# Altium project PCB_Project.PrjPcb
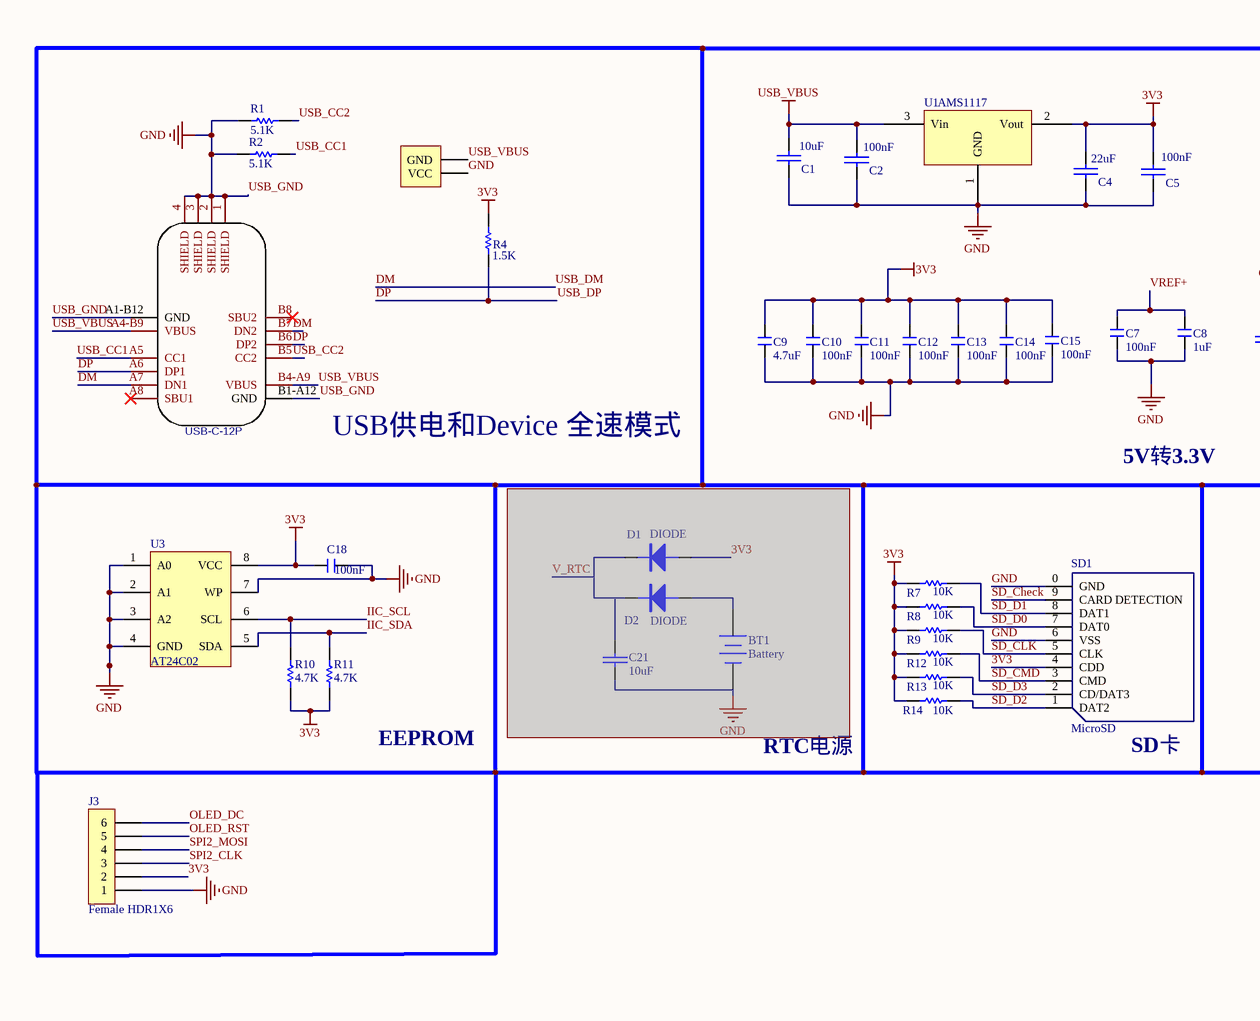
[diagram p0: Sheet1.SchDoc, top left]
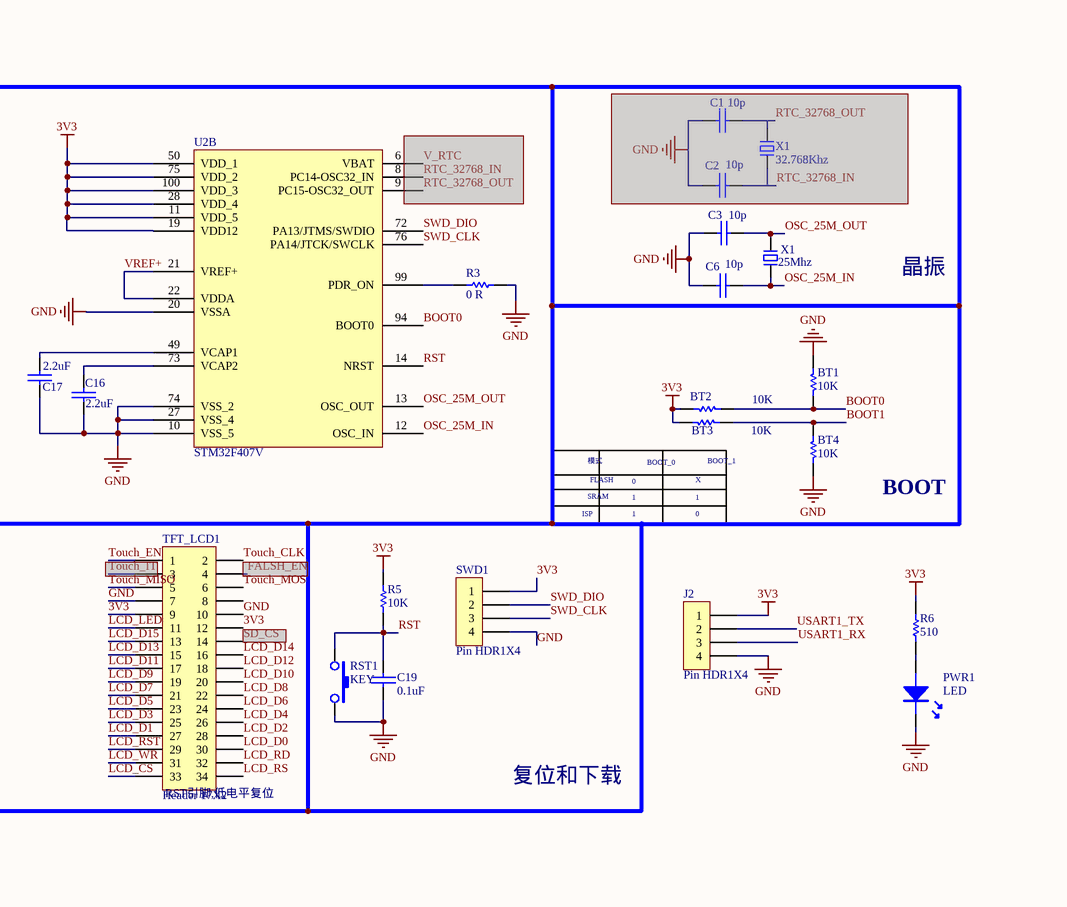
[diagram p1: Sheet1.SchDoc, top middle]
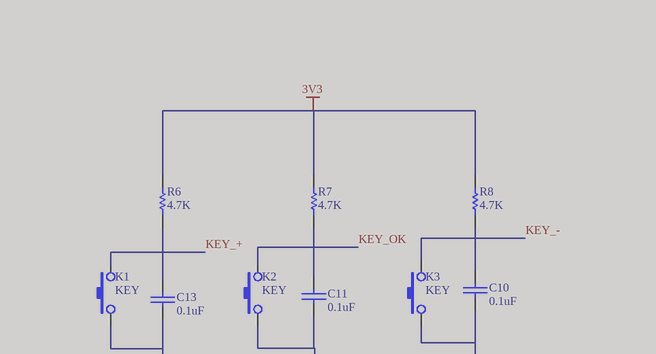
[diagram p2: Sheet1.SchDoc, top right]
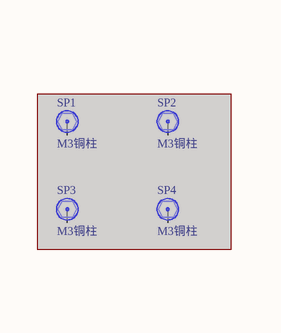
[diagram p3: Sheet1.SchDoc, bottom left]
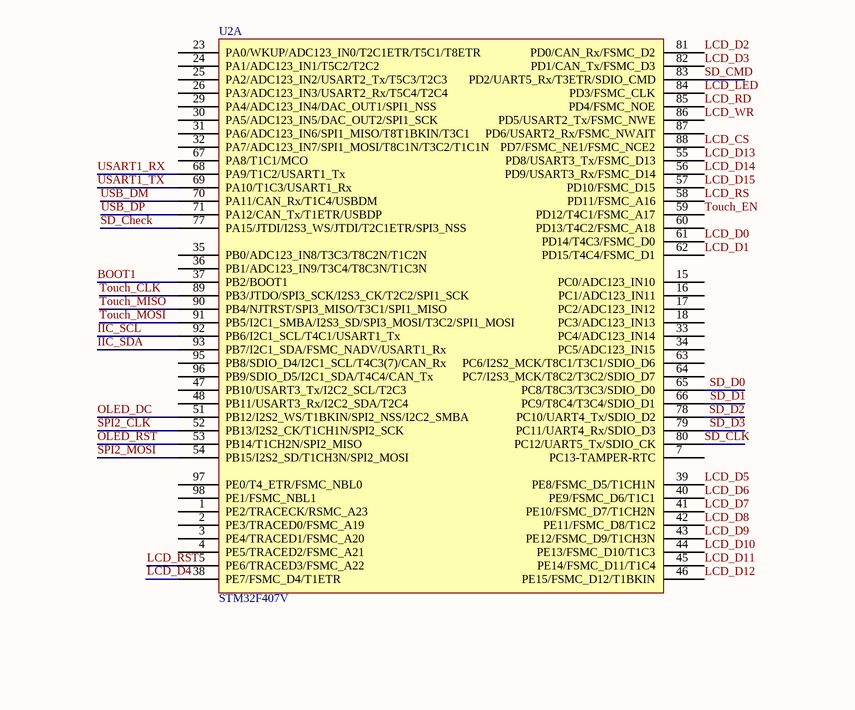
[diagram p4: Sheet1.SchDoc, bottom middle]
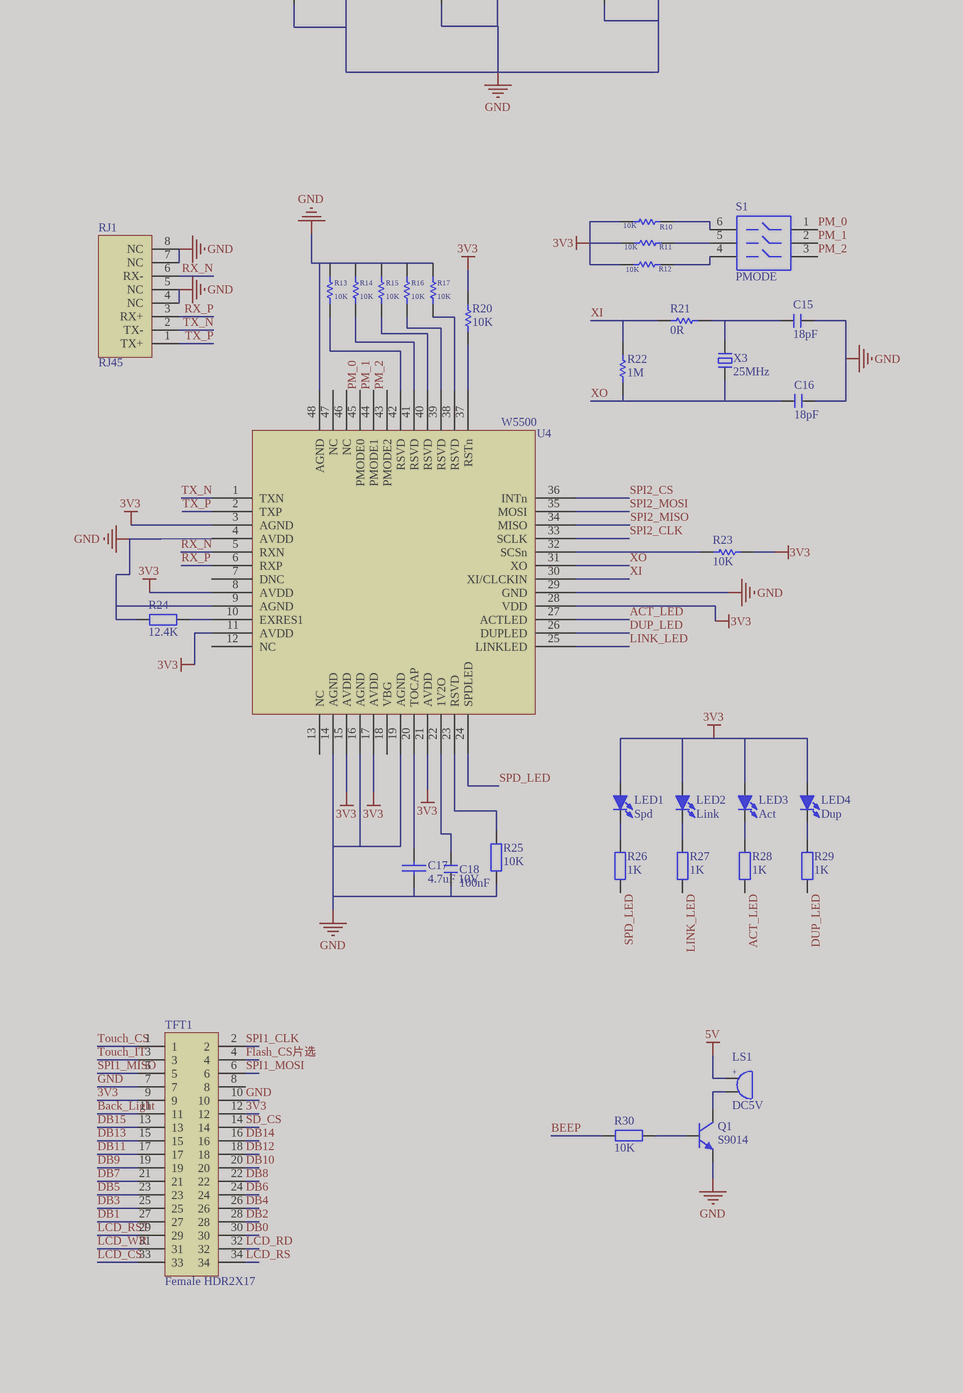
[diagram p5: Sheet1.SchDoc, bottom right]
1 sheet, 104 parts. Net scope: global (net labels, ports and power ports of the same name join across sheets).
Board file: PCB1.PcbDoc

## Sheet Sheet1.SchDoc
size A1

### Parts
(Parts that share a designator on the sheet are numbered #1, #2 ... from top to bottom, then left to right.)
1  USB-C-12P  [USB-C-12P]
BT1#1  10K  [0603R]
BT1#2  Battery  [CR1220]  (masked out: inside a compile mask, not in the netlist)
BT2  10K  [0603R]
BT3  10K  [0603R]
BT4  10K  [0603R]
C1#1  10p  [0603C]  (masked out: inside a compile mask, not in the netlist)
C1#2  10uF  [0603C]
C2#1  10p  [0603C]  (masked out: inside a compile mask, not in the netlist)
C2#2  100nF  [0603C]
C3  10p  [0603C]
C4  22uF  [0603C]
C5  100nF  [0603C]
C6  10p  [0603C]
C7  100nF  [C 0603_L]
C8  1uF  [C 0603_L]
C9  4.7uF  [C 0603_L]
C10#1  100nF  [C 0603_L]
C10#2  0.1uF  [0805C]  (masked out: inside a compile mask, not in the netlist)
C11#1  100nF  [C 0603_L]
C11#2  0.1uF  [0805C]  (masked out: inside a compile mask, not in the netlist)
C12  100nF  [C 0603_L]
C13#1  100nF  [C 0603_L]
C13#2  0.1uF  [0805C]  (masked out: inside a compile mask, not in the netlist)
C14  100nF  [C 0603_L]
C15#1  100nF  [C 0603_L]
C15#2  18pF  [C 0603_M]  (masked out: inside a compile mask, not in the netlist)
C16#1  2.2uF  [0603C]
C16#2  18pF  [C 0603_M]  (masked out: inside a compile mask, not in the netlist)
C17#1  2.2uF  [0603C]
C17#2  4.7uF 10V  [0603C]  (masked out: inside a compile mask, not in the netlist)
C18#1  100nF  [C 0603_M]
C18#2  100nF  [C 0805_L]  (masked out: inside a compile mask, not in the netlist)
C19  0.1uF  [0603C]
C21  10uF  [0603C]  (masked out: inside a compile mask, not in the netlist)
D1  DIODE  [SOD-323]  (masked out: inside a compile mask, not in the netlist)
D2  DIODE  [SOD-323]  (masked out: inside a compile mask, not in the netlist)
J1  Power-2P  [XH2.54-2]  (value not drawn)
J2  Pin HDR1X4  [Pin HDR1X4/2.54mm-S]
J3  Female HDR1X6  [Fe-HDR1X6/2.54-S]
K1  KEY  [DIP-6X6X5]  (masked out: inside a compile mask, not in the netlist)
K2  KEY  [DIP-6X6X5]  (masked out: inside a compile mask, not in the netlist)
K3  KEY  [DIP-6X6X5]  (masked out: inside a compile mask, not in the netlist)
LED1  Spd  [LED 0805R]  (masked out: inside a compile mask, not in the netlist)
LED2  Link  [LED 0805G]  (masked out: inside a compile mask, not in the netlist)
LED3  Act  [LED 0805B]  (masked out: inside a compile mask, not in the netlist)
LED4  Dup  [LED 0805Y]  (masked out: inside a compile mask, not in the netlist)
LS1  DC5V  [BEEP 5x9x5.5]  (masked out: inside a compile mask, not in the netlist)
PWR1  LED  [LED-0603G]
Q1  S9014  [SOT23-3M]  (masked out: inside a compile mask, not in the netlist)
R1  5.1K  [0603R]
R2  5.1K  [0603R]
R3  0 R  [0603R]
R4  1.5K  [0603R]
R5  10K  [0603R]
R6#1  510  [0603R]
R6#2  4.7K  [0603R]  (masked out: inside a compile mask, not in the netlist)
R7#1  10K  [0603R]
R7#2  4.7K  [0603R]  (masked out: inside a compile mask, not in the netlist)
R8#1  10K  [0603R]
R8#2  4.7K  [0603R]  (masked out: inside a compile mask, not in the netlist)
R9  10K  [0603R]
R10#1  4.7K  [0603R]
R10#2  10K  [0603R]  (masked out: inside a compile mask, not in the netlist)
R11#1  4.7K  [0603R]
R11#2  10K  [0603R]  (masked out: inside a compile mask, not in the netlist)
R12#1  10K  [0603R]
R12#2  10K  [0603R]  (masked out: inside a compile mask, not in the netlist)
R13#1  10K  [0603R]
R13#2  10K  [0603R]  (masked out: inside a compile mask, not in the netlist)
R14#1  10K  [0603R]
R14#2  10K  [0603R]  (masked out: inside a compile mask, not in the netlist)
R15  10K  [0603R]  (masked out: inside a compile mask, not in the netlist)
R16  10K  [0603R]  (masked out: inside a compile mask, not in the netlist)
R17  10K  [0603R]  (masked out: inside a compile mask, not in the netlist)
R20  10K  [0603R]  (masked out: inside a compile mask, not in the netlist)
R21  0R  [0603R]  (masked out: inside a compile mask, not in the netlist)
R22  1M  [0603R]  (masked out: inside a compile mask, not in the netlist)
R23  10K  [0603R]  (masked out: inside a compile mask, not in the netlist)
R24  12.4K  [R 0603_L]  (masked out: inside a compile mask, not in the netlist)
R25  10K  [R 0603_M]  (masked out: inside a compile mask, not in the netlist)
R26  1K  [R 0805_L]  (masked out: inside a compile mask, not in the netlist)
R27  1K  [R 0805_L]  (masked out: inside a compile mask, not in the netlist)
R28  1K  [R 0805_L]  (masked out: inside a compile mask, not in the netlist)
R29  1K  [R 0805_L]  (masked out: inside a compile mask, not in the netlist)
R30  10K  [R 0603_M]  (masked out: inside a compile mask, not in the netlist)
RJ1  RJ45  [RJ45-2]  (masked out: inside a compile mask, not in the netlist)
RST1  KEY  [DIP-3X6X5]
S1  PMODE  [DIP-3P_R]  (masked out: inside a compile mask, not in the netlist)
SD1  MicroSD  [Micro SD]
SP1  M3铜柱  [M3x5_L]  (masked out: inside a compile mask, not in the netlist)
SP2  M3铜柱  [M3x5_L]  (masked out: inside a compile mask, not in the netlist)
SP3  M3铜柱  [M3x5_L]  (masked out: inside a compile mask, not in the netlist)
SP4  M3铜柱  [M3x5_L]  (masked out: inside a compile mask, not in the netlist)
SWD1  Pin HDR1X4  [Pin HDR1X4/2.54mm-S]
TFT1  Female HDR2X17  [Fe-HDR2X17/2.54-S]  (masked out: inside a compile mask, not in the netlist)
TFT_LCD1  Header 17X2  [Fe-HDR2X17/2.54-S]
U1  AMS1117  [SOT223]
U2  STM32F407V  [LQFP100 14x14_M]  (parts A,B of 2)
U3  AT24C02  [SOP8]
U4  W5500  [LQFP48]  (masked out: inside a compile mask, not in the netlist)
X1#1  32.768Khz  [OSC-3x8-WI-B]  (masked out: inside a compile mask, not in the netlist)
X1#2  25Mhz  [OSC 5032-2P]
X3  25MHz  [OSC 6035-2P]  (masked out: inside a compile mask, not in the netlist)

### Nets
3V3: BT2.1 BT3.1 C4.2 C5.2 C9.1 C10#1.1 C11#1.1 C12.1 C13#1.1 C14.1 C15#1.1 C18#1.1 J2.1 J3.2 R4.1 R5.2 R6#1.2 R7#1.1 R8#1.1 R9.1 R10#1.1 R11#1.1 R12#1.1 R13#1.1 R14#1.1 SD1.4(CDD) SWD1.1 TFT_LCD1.9 TFT_LCD1.12 U1.2(Vout) U2.11(VDD_5) U2.19(VDD12) U2.28(VDD_4) U2.50(VDD_1) U2.75(VDD_2) U2.100(VDD_3) U3.8(VCC)
GND: 1.1(SHIELD) 1.2(SHIELD) 1.3(SHIELD) 1.4(SHIELD) 1.A1-B12(GND) 1.B1-A12(GND) BT1#1.2 BT4.1 C1#2.1 C2#2.1 C3.1 C4.1 C5.1 C6.1 C7.1 C8.1 C9.2 C10#1.2 C11#1.2 C12.2 C13#1.2 C14.2 C15#1.2 C16#1.2 C17#1.1 C18#1.2 C19.1 J1.1(VCC) J2.4 J3.1 PWR1.K R1.2 R2.2 R3.1 RST1.3 SD1.0(GND) SD1.6(VSS) SWD1.4 TFT_LCD1.7 TFT_LCD1.10 U1.1(GND) U2.10(VSS_5) U2.20(VSSA) U2.27(VSS_4) U2.74(VSS_2) U3.1(A0) U3.2(A1) U3.3(A2) U3.4(GND) U3.7(WP)  [also labelled USB_GND]
USB_VBUS: 1.A4-B9(VBUS) 1.B4-A9(VBUS) C1#2.2 C2#2.2 J1.2(GND) U1.3(Vin)
BOOT0: BT1#1.1 BT2.2 U2.94(BOOT0)
BOOT1: BT3.2 BT4.2 U2.37(PB2/BOOT1)
DM: 1.A7(DN1) 1.B7(DN2) U2.70(PA11/CAN_Rx/T1C4/USBDM)  [also labelled USB_DM]
DP: 1.A6(DP1) 1.B6(DP2) R4.2 U2.71(PA12/CAN_Tx/T1ETR/USBDP)  [also labelled USB_DP]
IIC_SCL: R10#1.2 U2.92(PB6/I2C1_SCL/T4C1/USART1_Tx) U3.6(SCL)
IIC_SDA: R11#1.2 U2.93(PB7/I2C1_SDA/FSMC_NADV/USART1_Rx) U3.5(SDA)
LCD_CS: TFT_LCD1.33 U2.88(PD7/FSMC_NE1/FSMC_NCE2)
LCD_D0: TFT_LCD1.30 U2.61(PD14/T4C3/FSMC_D0)
LCD_D1: TFT_LCD1.27 U2.62(PD15/T4C4/FSMC_D1)
LCD_D2: TFT_LCD1.28 U2.81(PD0/CAN_Rx/FSMC_D2)
LCD_D3: TFT_LCD1.25 U2.82(PD1/CAN_Tx/FSMC_D3)
LCD_D4: TFT_LCD1.26 U2.38(PE7/FSMC_D4/T1ETR)
LCD_D5: TFT_LCD1.23 U2.39(PE8/FSMC_D5/T1CH1N)
LCD_D6: TFT_LCD1.24 U2.40(PE9/FSMC_D6/T1C1)
LCD_D7: TFT_LCD1.21 U2.41(PE10/FSMC_D7/T1CH2N)
LCD_D8: TFT_LCD1.22 U2.42(PE11/FSMC_D8/T1C2)
LCD_D9: TFT_LCD1.19 U2.43(PE12/FSMC_D9/T1CH3N)
LCD_D10: TFT_LCD1.20 U2.44(PE13/FSMC_D10/T1C3)
LCD_D11: TFT_LCD1.17 U2.45(PE14/FSMC_D11/T1C4)
LCD_D12: TFT_LCD1.18 U2.46(PE15/FSMC_D12/T1BKIN)
LCD_D13: TFT_LCD1.15 U2.55(PD8/USART3_Tx/FSMC_D13)
LCD_D14: TFT_LCD1.16 U2.56(PD9/USART3_Rx/FSMC_D14)
LCD_D15: TFT_LCD1.13 U2.57(PD10/FSMC_D15)
LCD_LED: TFT_LCD1.11 U2.84(PD3/FSMC_CLK)
LCD_RD: TFT_LCD1.32 U2.85(PD4/FSMC_NOE)
LCD_RS: TFT_LCD1.34 U2.58(PD11/FSMC_A16)
LCD_RST: TFT_LCD1.29 U2.5(PE6/TRACED3/FSMC_A22)
LCD_WR: TFT_LCD1.31 U2.86(PD5/USART2_Tx/FSMC_NWE)
OLED_DC: J3.6 U2.51(PB12/I2S2_WS/T1BKIN/SPI2_NSS/I2C2_SMBA)
OLED_RST: J3.5 U2.53(PB14/T1CH2N/SPI2_MISO)
OSC_25M_IN: C6.2 U2.12(OSC_IN) X1#2.1
OSC_25M_OUT: C3.2 U2.13(OSC_OUT) X1#2.2
RST: C19.2 R5.1 RST1.1 U2.14(NRST)
SD_Check: SD1.9(CARD_DETECTION) U2.77(PA15/JTDI/I2S3_WS/JTDI/T2C1ETR/SPI3_NSS)
SD_CLK: R9.2 SD1.5(CLK) U2.80(PC12/UART5_Tx/SDIO_CK)
SD_CMD: R12#1.2 SD1.3(CMD) U2.83(PD2/UART5_Rx/T3ETR/SDIO_CMD)
SD_D0: R8#1.2 SD1.7(DAT0) U2.65(PC8/T8C3/T3C3/SDIO_D0)
SD_D1: R7#1.2 SD1.8(DAT1) U2.66(PC9/T8C4/T3C4/SDIO_D1)
SD_D2: R14#1.2 SD1.1(DAT2) U2.78(PC10/UART4_Tx/SDIO_D2)
SD_D3: R13#1.2 SD1.2(CD/DAT3) U2.79(PC11/UART4_Rx/SDIO_D3)
SPI2_CLK: J3.3 U2.52(PB13/I2S2_CK/T1CH1N/SPI2_SCK)
SPI2_MOSI: J3.4 U2.54(PB15/I2S2_SD/T1CH3N/SPI2_MOSI)
SWD_CLK: SWD1.3 U2.76(PA14/JTCK/SWCLK)
SWD_DIO: SWD1.2 U2.72(PA13/JTMS/SWDIO)
Touch_CLK: TFT_LCD1.2 U2.89(PB3/JTDO/SPI3_SCK/I2S3_CK/T2C2/SPI1_SCK)
Touch_EN: TFT_LCD1.1 U2.59(PD12/T4C1/FSMC_A17)
Touch_MISO: TFT_LCD1.5 U2.90(PB4/NJTRST/SPI3_MISO/T3C1/SPI1_MISO)
Touch_MOSI: TFT_LCD1.6 U2.91(PB5/I2C1_SMBA/I2S3_SD/SPI3_MOSI/T3C2/SPI1_MOSI)
USART1_RX: J2.3 U2.68(PA9/T1C2/USART1_Tx)
USART1_TX: J2.2 U2.69(PA10/T1C3/USART1_Rx)
USB_CC1: 1.A5(CC1) R2.1
USB_CC2: 1.B5(CC2) R1.1
VREF+: C7.2 C8.2 U2.21(VREF+) U2.22(VDDA)
NetC16#1_1: C16#1.1 U2.73(VCAP2)
NetC17#1_2: C17#1.2 U2.49(VCAP1)
NetPWR1_A: PWR1.A R6#1.1
NetR3_2: R3.2 U2.99(PDR_ON)

Not connected (* = marked no-connect by the designer): 1 A8(SBU1)* B8(SBU2)*; TFT_LCD1 3 4 8 14; U2 1(PE2/TRACECK/RSMC_A23) 2(PE3/TRACED0/FSMC_A19) 3(PE4/TRACED1/FSMC_A20) 4(PE5/TRACED2/FSMC_A21) 6(VBAT) 7(PC13-TAMPER-RTC) 8(PC14-OSC32_IN) 9(PC15-OSC32_OUT) 15(PC0/ADC123_IN10) 16(PC1/ADC123_IN11) 17(PC2/ADC123_IN12) 18(PC3/ADC123_IN13) 23(PA0/WKUP/ADC123_IN0/T2C1ETR/T5C1/T8ETR) 24(PA1/ADC123_IN1/T5C2/T2C2) 25(PA2/ADC123_IN2/USART2_Tx/T5C3/T2C3) 26(PA3/ADC123_IN3/USART2_Rx/T5C4/T2C4) 29(PA4/ADC123_IN4/DAC_OUT1/SPI1_NSS) 30(PA5/ADC123_IN5/DAC_OUT2/SPI1_SCK) 31(PA6/ADC123_IN6/SPI1_MISO/T8T1BKIN/T3C1) 32(PA7/ADC123_IN7/SPI1_MOSI/T8C1N/T3C2/T1C1N) 33(PC4/ADC123_IN14) 34(PC5/ADC123_IN15) 35(PB0/ADC123_IN8/T3C3/T8C2N/T1C2N) 36(PB1/ADC123_IN9/T3C4/T8C3N/T1C3N) 47(PB10/USART3_Tx/I2C2_SCL/T2C3) 48(PB11/USART3_Rx/I2C2_SDA/T2C4) 60(PD13/T4C2/FSMC_A18) 63(PC6/I2S2_MCK/T8C1/T3C1/SDIO_D6) 64(PC7/I2S3_MCK/T8C2/T3C2/SDIO_D7) 67(PA8/T1C1/MCO) 87(PD6/USART2_Rx/FSMC_NWAIT) 95(PB8/SDIO_D4/I2C1_SCL/T4C3(7)/CAN_Rx) 96(PB9/SDIO_D5/I2C1_SDA/T4C4/CAN_Tx) 97(PE0/T4_ETR/FSMC_NBL0) 98(PE1/FSMC_NBL1)

### Notes on the sheet
- 晶振
- USB供电和Device 全速模式
- 5V转3.3V
- 模式
- SRAM
- FLASH
- 0
- 1
- BOOT_0
- X
- BOOT_1
- BOOT
- ISP
- EEPROM
- RTC电源
- SD卡
- (near TFT_LCD1) RST引脚,低电平复位
- 复位和下载
- (in symbol BEEP) +

### Library data of the parts
1 = USB-C-12P: BOM_Manufacturer: SOFNG; BOM_Manufacturer Part: MC-311D; Contributor: LCSC; BOM_Supplier: LCSC; BOM_Supplier Part: C136423; BOM_JLCPCB Part Class: Extended Part; spicePre: U; spiceSymbolName: MC-311D
BT1#1 BT2-BT4 R1-R5 R6#1 R6#2 R7#1 R7#2 R8#1 R8#2 R9 R10#1 R10#2 R11#1 R11#2 R12#1 R12#2 R13#1 R13#2 R14#1 R14#2 R15-R17 R20-R23 = RES
BT1#2 = Battery: 备份电池; Published: 24-Mar-1999; LatestRevisionDate: 17-Jul-2002; LatestRevisionNote: Re-released for DXP Platform.; PackageReference: BAT-2; Publisher: Altium Limited
C1#1 C1#2 C2#1 C2#2 C3-C6 C10#2 C11#2 C13#2 C16#1 C17#1 C17#2 C19 C21 = CAP: 无极性电容
C7-C9 C10#1 C11#1 C12 C13#1 C14 C15#1 C15#2 C16#2 C18#1 C18#2 = C: 无极性贴片电容; 版权归属: 源创客; BOM名称: 无极性贴片电容; 学习资源: www.ooocke.com
D1 D2 = DIODE: 普通二极管
J1 = PWR-2P: 供电端子
LED1-LED4 = LED-SMD: 贴片LED; 版权归属: 源创客; BOM名称: 贴片LED; 学习资源: www.ooocke.com
LS1 = BEEP: 蜂鸣器; 版权归属: 源创客; BOM名称: 蜂鸣器; 学习资源: www.ooocke.com
Q1 = 9014-SMD: 低噪放大-NPN型; 版权归属: 源创客; 属性: 50V 0.1A 0.4W 150MHZ; BOM名称: 低噪放大-NPN型; 学习资源: www.ooocke.com
R24-R30 = R: 贴片电阻; 版权归属: 源创客; BOM名称: 贴片电阻; 学习资源: www.ooocke.com
RJ1 = RJ45: 以太网接口; 版权归属: 源创客; BOM名称: 以太网接口; 学习资源: www.ooocke.com
S1 = SW3-DIP6
SP1-SP4 = 铜柱小焊盘: 铜柱; 版权归属: 源创客; BOM名称: 铜柱; 学习资源: www.ooocke.com
TFT_LCD1 = Header 17X2: Header, 17-Pin, Dual row; LatestRevisionDate: 17-Jul-2002; LatestRevisionNote: Re-released for DXP Platform.; Publisher: Altium Limited
U1 = AMS1117: 三端稳压芯片
U2 = STM32F407V: STM32单片机100引脚
U4 = W5500: 网络芯片
X1#1 X1#2 = XTAL-2P: 2脚无源脚晶振
X3 = XTAL-2P: 2脚无源脚晶振; 版权归属: 源创客; BOM名称: 2脚无源脚晶振; 学习资源: www.ooocke.com